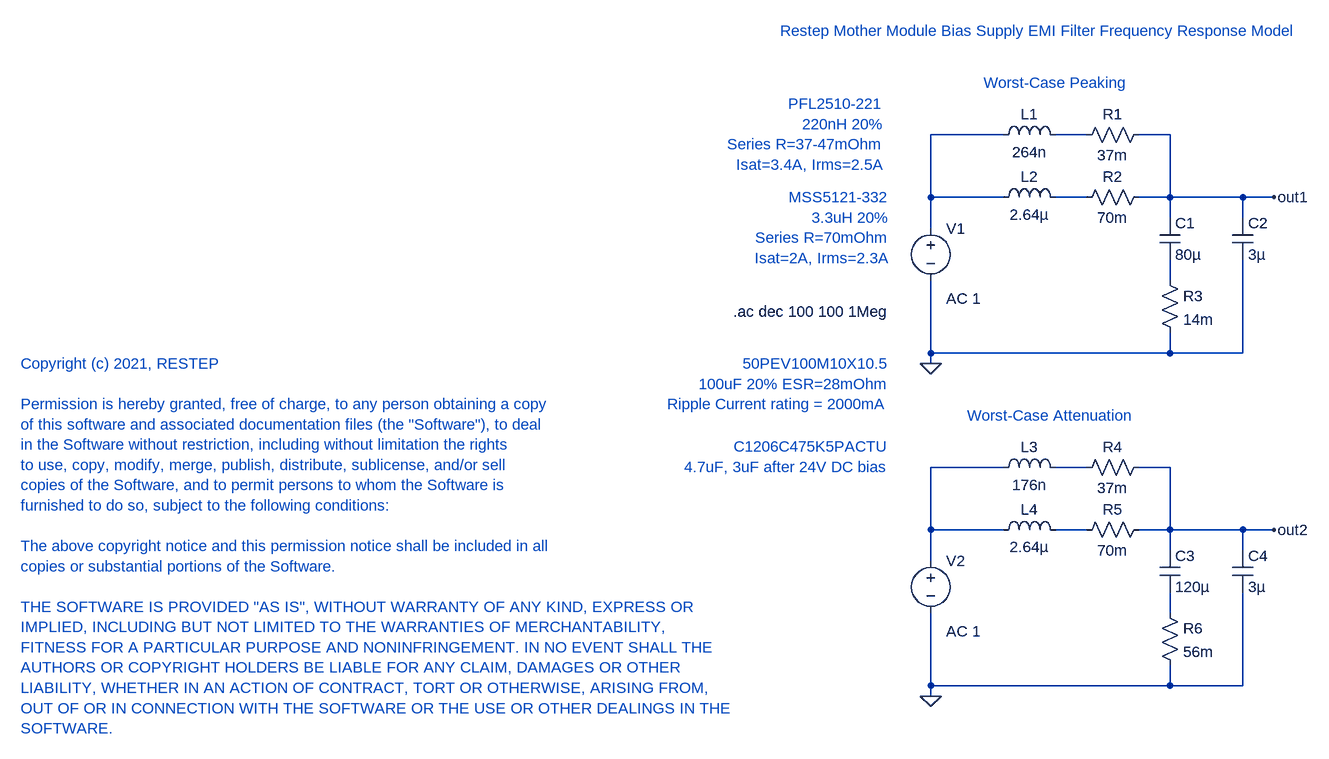
[diagram p0: schematic RESTEP-BiasSupply-EMIfilter-Freq.asc]
RESTEP-BiasSupply-EMIfilter-Freq.asc, the LTspice schematic file:
Version 4
SHEET 1 880 996
WIRE -672 0 -784 0
WIRE -544 0 -592 0
WIRE -416 0 -464 0
WIRE -784 96 -784 0
WIRE -672 96 -784 96
WIRE -544 96 -592 96
WIRE -416 96 -416 0
WIRE -416 96 -464 96
WIRE -304 96 -416 96
WIRE -256 96 -304 96
WIRE -416 128 -416 96
WIRE -304 128 -304 96
WIRE -784 144 -784 96
WIRE -416 224 -416 192
WIRE -784 336 -784 224
WIRE -416 336 -416 304
WIRE -416 336 -784 336
WIRE -304 336 -304 192
WIRE -304 336 -416 336
WIRE -784 352 -784 336
WIRE -672 512 -784 512
WIRE -544 512 -592 512
WIRE -416 512 -464 512
WIRE -784 608 -784 512
WIRE -672 608 -784 608
WIRE -544 608 -592 608
WIRE -416 608 -416 512
WIRE -416 608 -464 608
WIRE -304 608 -416 608
WIRE -256 608 -304 608
WIRE -416 640 -416 608
WIRE -304 640 -304 608
WIRE -784 656 -784 608
WIRE -416 736 -416 704
WIRE -784 848 -784 736
WIRE -416 848 -416 816
WIRE -416 848 -784 848
WIRE -304 848 -304 704
WIRE -304 848 -416 848
WIRE -784 864 -784 848
FLAG -256 96 out1
FLAG -784 352 0
FLAG -256 608 out2
FLAG -784 864 0
SYMBOL voltage -784 128 R0
WINDOW 123 24 124 Left 2
WINDOW 39 0 0 Left 2
SYMATTR Value2 AC 1
SYMATTR InstName V1
SYMATTR Value ""
SYMBOL ind -688 16 R270
WINDOW 0 32 56 VTop 2
WINDOW 3 5 56 VBottom 2
SYMATTR InstName L1
SYMATTR Value 264n
SYMBOL ind -688 112 R270
WINDOW 0 32 56 VTop 2
WINDOW 3 5 56 VBottom 2
SYMATTR InstName L2
SYMATTR Value 2.64µ
SYMBOL res -448 -16 R90
WINDOW 0 0 56 VBottom 2
WINDOW 3 32 56 VTop 2
SYMATTR InstName R1
SYMATTR Value 37m
SYMBOL res -448 80 R90
WINDOW 0 0 56 VBottom 2
WINDOW 3 32 56 VTop 2
SYMATTR InstName R2
SYMATTR Value 70m
SYMBOL cap -432 128 R0
SYMATTR InstName C1
SYMATTR Value 80µ
SYMBOL res -432 208 R0
SYMATTR InstName R3
SYMATTR Value 14m
SYMBOL cap -320 128 R0
SYMATTR InstName C2
SYMATTR Value 3µ
SYMBOL ind -688 528 R270
WINDOW 0 32 56 VTop 2
WINDOW 3 5 56 VBottom 2
SYMATTR InstName L3
SYMATTR Value 176n
SYMBOL ind -688 624 R270
WINDOW 0 32 56 VTop 2
WINDOW 3 5 56 VBottom 2
SYMATTR InstName L4
SYMATTR Value 2.64µ
SYMBOL res -448 496 R90
WINDOW 0 0 56 VBottom 2
WINDOW 3 32 56 VTop 2
SYMATTR InstName R4
SYMATTR Value 37m
SYMBOL res -448 592 R90
WINDOW 0 0 56 VBottom 2
WINDOW 3 32 56 VTop 2
SYMATTR InstName R5
SYMATTR Value 70m
SYMBOL cap -432 640 R0
SYMATTR InstName C3
SYMATTR Value 120µ
SYMBOL res -432 720 R0
SYMATTR InstName R6
SYMATTR Value 56m
SYMBOL cap -320 640 R0
SYMATTR InstName C4
SYMATTR Value 3µ
SYMBOL voltage -784 640 R0
WINDOW 123 24 124 Left 2
WINDOW 39 0 0 Left 2
SYMATTR Value2 AC 1
SYMATTR InstName V2
SYMATTR Value ""
TEXT -848 96 Right 2 ;MSS5121-332\n3.3uH 20%\nSeries R=70mOhm\nIsat=2A, Irms=2.3A
TEXT -856 -48 Right 2 ;PFL2510-221\n220nH 20%\nSeries R=37-47mOhm\nIsat=3.4A, Irms=2.5A
TEXT -848 352 Right 2 ;50PEV100M10X10.5\n100uF 20% ESR=28mOhm\nRipple Current rating = 2000mA
TEXT -848 480 Right 2 ;C1206C475K5PACTU\n4.7uF, 3uF after 24V DC bias
TEXT -1088 272 Left 2 !.ac dec 100 100 1Meg
TEXT -592 -80 Center 2 ;Worst-Case Peaking
TEXT -600 432 Center 2 ;Worst-Case Attenuation
TEXT -616 -160 Center 2 ;Restep Mother Module Bias Supply EMI Filter Frequency Response Model
TEXT -2184 352 Left 2 ;Copyright (c) 2021, RESTEP\n \nPermission is hereby granted, free of charge, to any person obtaining a copy\nof this software and associated documentation files (the "Software"), to deal\nin the Software without restriction, including without limitation the rights\nto use, copy, modify, merge, publish, distribute, sublicense, and/or sell\ncopies of the Software, and to permit persons to whom the Software is\nfurnished to do so, subject to the following conditions:\n \nThe above copyright notice and this permission notice shall be included in all\ncopies or substantial portions of the Software.\n \nTHE SOFTWARE IS PROVIDED "AS IS", WITHOUT WARRANTY OF ANY KIND, EXPRESS OR\nIMPLIED, INCLUDING BUT NOT LIMITED TO THE WARRANTIES OF MERCHANTABILITY,\nFITNESS FOR A PARTICULAR PURPOSE AND NONINFRINGEMENT. IN NO EVENT SHALL THE\nAUTHORS OR COPYRIGHT HOLDERS BE LIABLE FOR ANY CLAIM, DAMAGES OR OTHER\nLIABILITY, WHETHER IN AN ACTION OF CONTRACT, TORT OR OTHERWISE, ARISING FROM,\nOUT OF OR IN CONNECTION WITH THE SOFTWARE OR THE USE OR OTHER DEALINGS IN THE\nSOFTWARE.

The netlist it stands for:
* RESTEP-BiasSupply-EMIfilter-Freq.asc
V1 N001 0 AC 1
L1 N001 N002 264n
L2 N001 N003 2.64µ
R1 out1 N002 37m
R2 out1 N003 70m
C1 out1 N004 80µ
R3 N004 0 14m
C2 out1 0 3µ
L3 N005 N006 176n
L4 N005 N007 2.64µ
R4 out2 N006 37m
R5 out2 N007 70m
C3 out2 N008 120µ
R6 N008 0 56m
C4 out2 0 3µ
V2 N005 0 AC 1
* MSS5121-332
* 3.3uH 20%
* Series R=70mOhm
* Isat=2A, Irms=2.3A
* PFL2510-221
* 220nH 20%
* Series R=37-47mOhm
* Isat=3.4A, Irms=2.5A
* 50PEV100M10X10.5
* 100uF 20% ESR=28mOhm
* Ripple Current rating = 2000mA
* C1206C475K5PACTU
* 4.7uF, 3uF after 24V DC bias
.ac dec 100 100 1Meg
* Worst-Case Peaking
* Worst-Case Attenuation
* Restep Mother Module Bias Supply EMI Filter Frequency Response Model
* Copyright (c) 2021, RESTEP
* Permission is hereby granted, free of charge, to any person obtaining a copy
* of this software and associated documentation files (the "Software"), to deal
* in the Software without restriction, including without limitation the rights
* to use, copy, modify, merge, publish, distribute, sublicense, and/or sell
* copies of the Software, and to permit persons to whom the Software is
* furnished to do so, subject to the following conditions:
* The above copyright notice and this permission notice shall be included in all
* copies or substantial portions of the Software.
* THE SOFTWARE IS PROVIDED "AS IS", WITHOUT WARRANTY OF ANY KIND, EXPRESS OR
* IMPLIED, INCLUDING BUT NOT LIMITED TO THE WARRANTIES OF MERCHANTABILITY,
* FITNESS FOR A PARTICULAR PURPOSE AND NONINFRINGEMENT. IN NO EVENT SHALL THE
* AUTHORS OR COPYRIGHT HOLDERS BE LIABLE FOR ANY CLAIM, DAMAGES OR OTHER
* LIABILITY, WHETHER IN AN ACTION OF CONTRACT, TORT OR OTHERWISE, ARISING FROM,
* OUT OF OR IN CONNECTION WITH THE SOFTWARE OR THE USE OR OTHER DEALINGS IN THE
* SOFTWARE.
.backanno
.end